# EAGLE design porcupine4v1_7 (EAGLE 6.5.0)
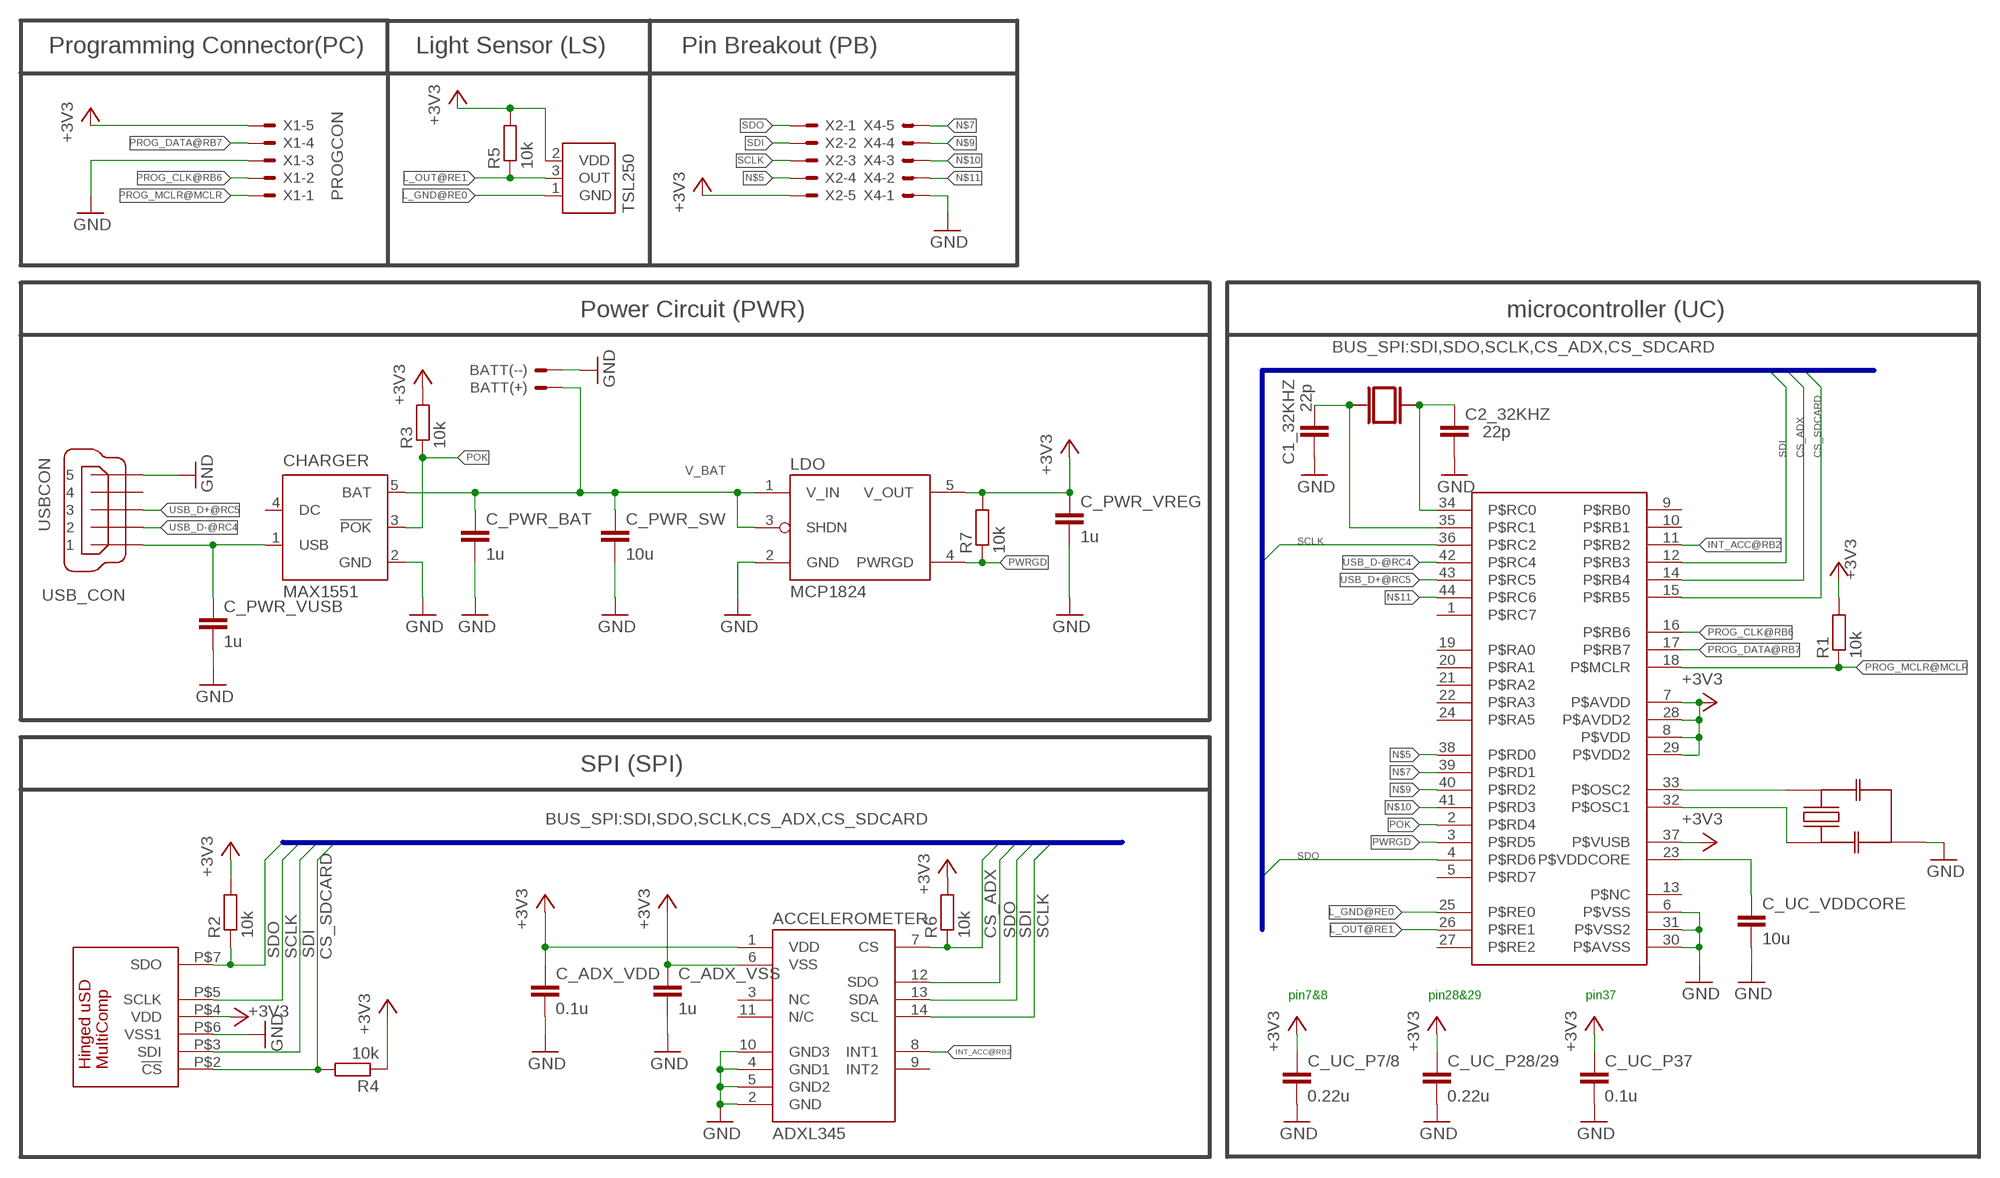
[diagram p0: schematic, sheet 1]

## Parts
12MHZ_RESONATOR  RESONATORPRQC-S  [PRQC]
32KHZ_CRYSTAL  SMD_CRYSTAL  [SMD_CRYSTAL]
ACCELEROMETER  ADXL345  [LGA14]
BATT  LI-ION-PACK  [LI-ION-CONNECT]
C1_32KHZ  22p  C-EUC0603K  [C0603K]
C2_32KHZ  22p  C-EUC0603K  [C0603K]
C_ADX_VDD  0.1u  C-EUC0603K  [C0603K]
C_ADX_VSS  1u  C-EUC0603K  [C0603K]
C_PWR_BAT  1u  C-EUC0603K  [C0603K]
C_PWR_SW  10u  C-EUC0805K  [C0805K]
C_PWR_VREG  1u  C-EUC0603K  [C0603K]
C_PWR_VUSB  1u  C-EUC0603K  [C0603K]
C_UC_P7/8  0.22u  C-EUC0603K  [C0603K]
C_UC_P28/29  0.22u  C-EUC0603K  [C0603K]
C_UC_P37  0.1u  C-EUC0603K  [C0603K]
C_UC_VDDCORE  10u  C-EUC0805K  [C0805K]
CHARGER  MAX1551  [SOT23-5L]
LDO  MCP1824  [SOT-23-5]
LIGHTSENSE  TSL250  [TSL]
PIC_CONTROLLER  PIC_P2V6  [QFN44ML8X8]
R1  10k  R-EU_R0603  [R0603]
R2  10k  R-EU_R0603  [R0603]
R3  10k  R-EU_R0603  [R0603]
R4  10k  R-EU_R0603  [R0603]
R5  10k  R-EU_R0603  [R0603]
R6  10k  R-EU_R0603  [R0603]
R7  10k  R-EU_R0603  [R0603]
SDCARD_CON  MICROSD_CONN  [460DA40013]
USB_CON  USBCON  [248601]
X1  PROGCON  [53047-05-OCT]
X2  PROGCON  [53047-05-OCT]
X4  PROGCON  [53047-05-OCT]

## Nets
+3V3: ACCELEROMETER.1(VDD) ACCELEROMETER.6(VSS) C_ADX_VDD.1 C_ADX_VSS.1 C_PWR_VREG.1 C_UC_P7/8.1 C_UC_P28/29.1 C_UC_P37.1 LDO.5(V_OUT) LIGHTSENSE.2(VDD) PIC_CONTROLLER.7(P$AVDD) PIC_CONTROLLER.8(P$VDD) PIC_CONTROLLER.28(P$AVDD2) PIC_CONTROLLER.29(P$VDD2) PIC_CONTROLLER.37(P$VUSB) R1.2 R2.2 R3.2 R4.1 R5.2 R6.2 R7.2 SDCARD_CON.P$4(VDD) X1.5 X2.5
CS_ADX: ACCELEROMETER.7(CS) PIC_CONTROLLER.14(P$RB4) R6.1
CS_SDCARD: PIC_CONTROLLER.15(P$RB5) R4.2 SDCARD_CON.P$2(!CS)
GND: 12MHZ_RESONATOR.GND ACCELEROMETER.2(GND) ACCELEROMETER.4(GND1) ACCELEROMETER.5(GND2) ACCELEROMETER.10(GND3) BATT.2 C1_32KHZ.2 C2_32KHZ.2 C_ADX_VDD.2 C_ADX_VSS.2 C_PWR_BAT.2 C_PWR_SW.2 C_PWR_VREG.2 C_PWR_VUSB.2 C_UC_P7/8.2 C_UC_P28/29.2 C_UC_P37.2 C_UC_VDDCORE.2 CHARGER.2(GND) LDO.2(GND) PIC_CONTROLLER.6(P$VSS) PIC_CONTROLLER.30(P$AVSS) PIC_CONTROLLER.31(P$VSS2) SDCARD_CON.P$6(VSS1) USB_CON.5 X1.3 X4.1
INT_ACC@RB2: ACCELEROMETER.8(INT1) PIC_CONTROLLER.11(P$RB2)
L_GND@RE0: LIGHTSENSE.1(GND) PIC_CONTROLLER.25(P$RE0)
L_OUT@RE1: LIGHTSENSE.3(OUT) PIC_CONTROLLER.26(P$RE1) R5.1
N$1: 12MHZ_RESONATOR.2 PIC_CONTROLLER.32(P$OSC1)
N$2: 12MHZ_RESONATOR.1 PIC_CONTROLLER.33(P$OSC2)
N$3: 32KHZ_CRYSTAL.P$2 C2_32KHZ.1 PIC_CONTROLLER.34(P$RC0)
N$5: PIC_CONTROLLER.38(P$RD0) X2.4
N$6: 32KHZ_CRYSTAL.P$1 C1_32KHZ.1 PIC_CONTROLLER.35(P$RC1)
N$7: PIC_CONTROLLER.39(P$RD1) X4.5
N$9: PIC_CONTROLLER.40(P$RD2) X4.4
N$10: PIC_CONTROLLER.41(P$RD3) X4.3
N$11: PIC_CONTROLLER.44(P$RC6) X4.2
POK: CHARGER.3(!POK) PIC_CONTROLLER.2(P$RD4) R3.1
PROG_CLK@RB6: PIC_CONTROLLER.16(P$RB6) X1.2
PROG_DATA@RB7: PIC_CONTROLLER.17(P$RB7) X1.4
PROG_MCLR@MCLR: PIC_CONTROLLER.18(P$MCLR) R1.1 X1.1
PWRGD: LDO.4(PWRGD) PIC_CONTROLLER.3(P$RD5) R7.1
SCLK: ACCELEROMETER.14(SCL) PIC_CONTROLLER.36(P$RC2) SDCARD_CON.P$5(SCLK) X2.3
SDI: ACCELEROMETER.13(SDA) PIC_CONTROLLER.12(P$RB3) SDCARD_CON.P$3(SDI) X2.2
SDO: ACCELEROMETER.12(SDO) PIC_CONTROLLER.4(P$RD6) R2.1 SDCARD_CON.P$7(SDO) X2.1
USB_D+@RC5: PIC_CONTROLLER.43(P$RC5) USB_CON.3
USB_D-@RC4: PIC_CONTROLLER.42(P$RC4) USB_CON.2
V_BAT: BATT.1 C_PWR_BAT.1 C_PWR_SW.1 CHARGER.5(BAT) LDO.1(V_IN) LDO.3(SHDN)
V_USB: C_PWR_VUSB.1 CHARGER.1(USB) USB_CON.1
VDDCORE: C_UC_VDDCORE.1 PIC_CONTROLLER.23(P$VDDCORE)
Unconnected: ACCELEROMETER.3(NC) ACCELEROMETER.9(INT2) ACCELEROMETER.11(N/C) CHARGER.4(DC) PIC_CONTROLLER.1(P$RC7) PIC_CONTROLLER.9(P$RB0) PIC_CONTROLLER.10(P$RB1) PIC_CONTROLLER.13(P$NC) PIC_CONTROLLER.19(P$RA0) PIC_CONTROLLER.20(P$RA1) PIC_CONTROLLER.21(P$RA2) PIC_CONTROLLER.22(P$RA3) PIC_CONTROLLER.24(P$RA5) PIC_CONTROLLER.27(P$RE2) USB_CON.4

## Buses
BUS_SPI:SDI,SDO,SCLK,CS_ADX,CS_SDCARD

## Notes on the sheet
- Programming Connector(PC) | Light Sensor (LS) | Pin Breakout (PB)
- Power Circuit (PWR) | microcontroller (UC)
- SPI (SPI)
- pin7&8 | pin28&29 | pin37

## Power pins joined to a net without a drawn wire
P$RD7: PIC_CONTROLLER.5(P$RD7)

## Library data of the parts
12MHZ_RESONATOR = jnode:RESONATOR: Ceramic Resonator with caps AWSCR-16.00CV-T: 16Mhz ceramic resonator with 22pF capacitors PRQC16.00SR5010X000: 16Mhz ceramic resonator with 10pF capacitors; DIGIKEY: http://www.digikey.com/product-detail/en/PRQC12.00CR5010X000/478-6318-1-ND/2506334
32KHZ_CRYSTAL = HedgehogLib:SMD_CRYSTAL
ACCELEROMETER = HedgehogLib:ADXL345
BATT = HedgehogLib:LI-ION-PACK: Lithium Ion Battery Pack
C1_32KHZ C2_32KHZ C_ADX_VDD C_ADX_VSS C_PWR_BAT C_PWR_SW C_PWR_VREG C_PWR_VUSB C_UC_P7/8 C_UC_P28/29 C_UC_P37 C_UC_VDDCORE = rcl:C-EU: CAPACITOR, European symbol
CHARGER = maxim:MAX1551: Dual-Input USB/AC Adapter 1-Cell Li+ Battery Chargers Source: http://www.maxim-ic.com .. MAX1551-MAX1555.pdf; MF: MAXIM; MPN: MAX1551EZK-T; OC_FARNELL: 1628221; OC_NEWARK: 88H0599
LDO = HedgehogLib:MCP1824: MCP1824T-3302E/OT http://de.farnell.com/1578387
LIGHTSENSE = HedgehogLib:TSL250
PIC_CONTROLLER = HedgehogLib:PIC_P2V6
R1-R7 = rcl:R-EU_: RESISTOR, European symbol
SDCARD_CON = HedgehogLib:MICROSD_CONN
USB_CON = HedgehogLib:USBCON: MINI USB 2.0 Connector TypeB
X1 X2 X4 = HedgehogLib:PROGCON: Programmer Connector wire to board 1.25 mm (.049 inch) pitch header

## Board
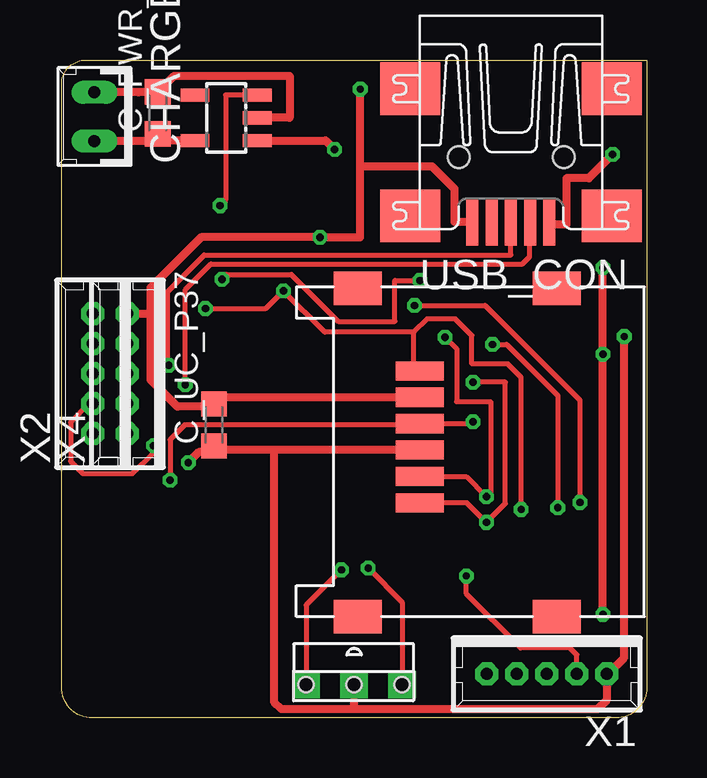
[diagram p1: board, top side]
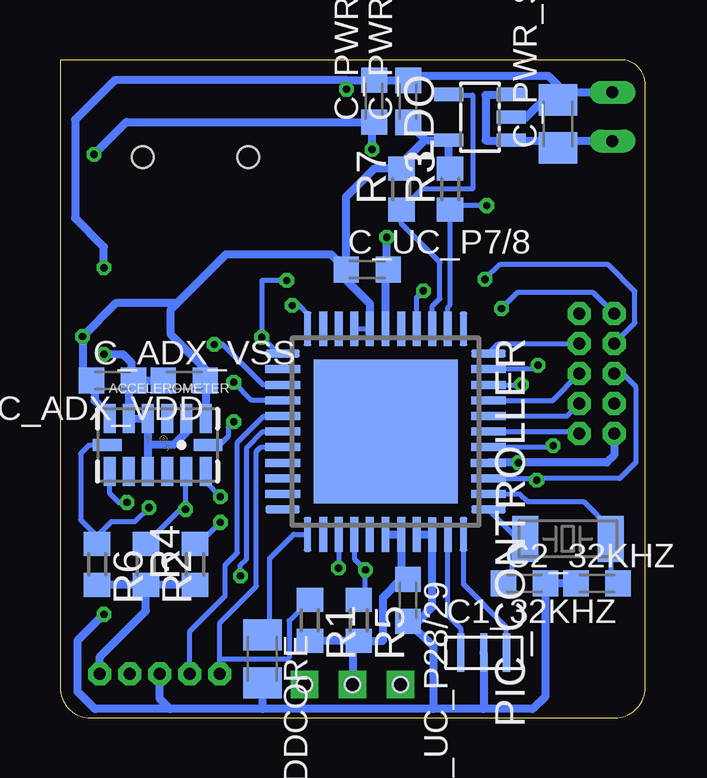
[diagram p2: board, bottom side, seen from below]

Size 24.38 x 27.43 mm. Coordinates in mm from the lower left corner, seen from the top.
Outline: 1.27,0 arc-90 0,1.27 0,26.42 arc-90 1.02,27.43 24.38,27.43 24.38,1.27 arc-90 23.11,0 1.27,0
Copper layers (1*16): Top 0.035mm / dielectric 1.5mm / Bottom 0.035mm
Design rules "default": minimum track width 6mil, minimum drill 12mil, track to track 7mil, track to pad 7mil, pad to pad 7mil, via to via 7mil, smd to smd 7mil, copper to edge 6mil, drill to drill 6mil, minimum pad ring 9mil, minimum via ring 6mil, stop-mask expansion 4mil, vias tented up to drill 0mil, thermal gap 10mil

### Footprints (pad centres in the part's own frame; a part is rotated, then mirrored left to right if it is on the bottom)
PRQC = smd 0.3 x 1.6: 1 -0.95,0; 2 0.95,0; GND 0,0
SMD_CRYSTAL = smd 1.092 x 1.905: P$1 1.794,0; P$2 -1.778,0
LGA14 = smd 0.5 x 1.2: 1 2,1.1; 2 1.2,1.1; 3 0.4,1.1; 4 -0.4,1.1; 5 -1.2,1.1; 6 -2,1.1; 8 -2,-1.1; 9 -1.2,-1.1; 10 -0.4,-1.1; 11 0.4,-1.1; 12 1.2,-1.1; 13 2,-1.1 | smd 1.2 x 0.5: 7 -2.1,0; 14 2.1,0
LI-ION-CONNECT = drill 0.5 pad 0.698 long: 1 -1.016,0; 2 1.016,0
C0603K = smd 1.05 x 1.08: 1 -0.875,0; 2 0.875,0
C0805K = smd 1.3 x 1.6: 1 -1,0; 2 1,0
SOT23-5L = smd 0.55 x 1.2: 1 -0.95,-1.3; 2 0,-1.3; 3 0.95,-1.3; 4 0.95,1.3; 5 -0.95,1.3
SOT-23-5 = smd 0.55 x 1.2: 1 -0.95,-1.3; 2 0,-1.3; 3 0.95,-1.3; 4 0.95,1.3; 5 -0.95,1.3
TSL = drill 0.635 pad 1.15 square: 1 -1.999,0; 2 0,0; 3 1.999,0 | hole 0.635: 0,0; -2,0; 2,0
QFN44ML8X8 = smd 1.45 x 0.33: 1 -4.282,3.25; 2 -4.285,2.6; 3 -4.285,1.95; 4 -4.285,1.3; 5 -4.285,0.65; 6 -4.287,0; 7 -4.285,-0.649; 8 -4.287,-1.3; 9 -4.287,-1.949; 10 -4.285,-2.6; 11 -4.285,-3.25; 23 4.285,-3.25; 24 4.287,-2.6; 25 4.287,-1.95; 26 4.287,-1.3; 27 4.287,-0.652; 28 4.287,0; 29 4.287,0.65; 30 4.292,1.3; 31 4.293,1.953; 32 4.293,2.602; 33 4.285,3.25 | smd 0.33 x 1.45: 12 -3.25,-4.288; 13 -2.6,-4.287; 14 -1.949,-4.287; 15 -1.3,-4.287; 16 -0.65,-4.287; 17 0,-4.287; 18 0.65,-4.287; 19 1.3,-4.287; 20 1.95,-4.287; 21 2.6,-4.287; 22 3.25,-4.285; 34 3.25,4.288; 35 2.6,4.287; 36 1.95,4.287; 37 1.3,4.285; 38 0.65,4.287; 39 0,4.287; 40 -0.649,4.287; 41 -1.3,4.287; 42 -1.949,4.287; 43 -2.6,4.287; 44 -3.25,4.288 | smd 6 x 6: EXP 0,0
R0603 = smd 1 x 1.1: 1 -0.85,0; 2 0.85,0
460DA40013 = smd 2 x 0.8: P$2 9.35,-4.75; P$3 9.35,-5.85; P$4 9.35,-6.95; P$5 9.35,-8.05; P$6 9.35,-9.15; P$7 9.35,-10.25 | smd 2 x 1.4: P$9A 11.95,0; P$9B 3.65,0; P$10A 11.95,-13.7; P$10B 3.65,-13.7
248601 = smd 2 x 0.5: 1 2.25,1.6; 2 2.25,0.8; 3 2.25,0; 4 2.25,-0.8; 5 2.25,-1.6 | smd 2.2 x 2.5: M1 -3.3,-4.2; M2 -3.3,4.2; M3 2,4.2; M4 2,-4.2 | hole 0.9: -0.449,-2.177; -0.447,2.21
53047-05-OCT = drill 0.5 pad 0.889 octagon: 1 2.5,0; 2 1.25,0; 3 0,0; 4 -1.25,0; 5 -2.5,0

### Placement (x,y rotation side)
12MHZ_RESONATOR  6.73,2.72 180 bottom
32KHZ_CRYSTAL  3.23,7.47 0 bottom
ACCELEROMETER  20.32,11.38 0 bottom
BATT  1.37,25.07 90 top
C1_32KHZ  2.01,5.61 180 bottom
C2_32KHZ  5.03,5.61 0 bottom
C_ADX_VDD  19.2,14.07 180 bottom
C_ADX_VSS  22.2,14.07 0 bottom
C_PWR_BAT  4.01,25.22 90 top
C_PWR_SW  3.63,24.77 90 bottom
C_PWR_VREG  9.88,25.7 90 bottom
C_PWR_VUSB  11.3,25.71 90 bottom
C_UC_P7/8  11.58,18.69 0 bottom
C_UC_P28/29  9.88,4.9 270 bottom
C_UC_P37  6.35,12.22 90 top
C_UC_VDDCORE  15.95,2.46 270 bottom
CHARGER  6.86,25.02 90 top
LDO  6.88,25.04 90 bottom
LIGHTSENSE  12.19,1.4 180 top
PIC_CONTROLLER  10.82,11.94 270 bottom
R1  13.97,4.06 270 bottom
R2  20.8,6.4 270 bottom
R3  8.13,22.05 90 bottom
R4  18.76,6.4 90 bottom
R5  11.94,4.06 270 bottom
R6  22.83,6.4 270 bottom
R7  10.16,22.05 90 bottom
SDCARD_CON  24.28,4.22 180 top
USB_CON  18.72,22.93 270 top
X1  20.22,1.83 180 top
X2  1.3,14.35 90 top
X4  2.74,14.35 90 top

### Tracks (layer width: path | path; a pad name or v marks a point on that pad's centre or on a via)
+3V3  (via drill 0.3)
  Top 0.33: 12.19,0.37 LIGHTSENSE.2 | 12.19,0.37 22.34,0.37 22.73,0.76 22.73,1.81 X1.5 22.76,1.83 23.44,2.52 v23.44,15.9 | 14.92,11.15 SDCARD_CON.P$4 8.85,11.17 | 8.85,11.17 6.43,11.17 C_UC_P37.1 6.42,11.09 5.73,11.09 v5.28,10.64 | 8.85,11.17 8.85,0.68 9.15,0.37 12.19,0.37
  Bottom 0.203: C_ADX_VDD.1 18.32,13.84 | PIC_CONTROLLER.7 PIC_CONTROLLER.8 | 23.19,13.93 C_ADX_VSS.1 23.1,14.03 23.44,14.38 | 18.34,13.85 C_ADX_VDD.1 | PIC_CONTROLLER.37 | 18.33,13.84 C_ADX_VDD.1 | 18.29,12.7 18.32,12.17 ACCELEROMETER.1
  Bottom 0.33: ACCELEROMETER.6 22.32,12.91 22.61,12.91 22.94,13.23 22.94,13.81 C_ADX_VSS.1 | 18.32,13.84 ACCELEROMETER.1 | v23.44,15.9 23.44,14.38 | PIC_CONTROLLER.7 11.47,17.27 12.46,18.26 C_UC_P7/8.1 | PIC_CONTROLLER.37 v5.28,10.64 1.6,10.64 1.29,10.95 X2.5 | R2.2 R6.2 | X1.5 22.72,2.56 20.8,4.47 R2.2 | 23.42,15.93 v23.44,15.9 | R4.1 R2.2 | v23.44,15.9 22.04,17.31 19.48,17.31 | R3.2 8.18,22.93 8.18,24.07 9.12,24.07 9.16,24.11 | 9.16,24.11 C_PWR_VREG.1 | 9.16,24.11 9.98,23.29 R7.2 11.29,22.9 12.46,21.73 C_UC_P7/8.1 | C_UC_P7/8.1 13.09,19.33 17.46,19.33 19.48,17.31 | C_ADX_VDD.1 18.33,14.54 19.76,15.98 19.76,17.03 19.48,17.31 | 12.19,3.21 R5.2 10.92,3.21 10.92,5.03 10.18,5.77 C_UC_P28/29.1 10.17,5.75 PIC_CONTROLLER.29 PIC_CONTROLLER.28 | 12.19,3.21 LIGHTSENSE.2 | 12.19,3.21 R1.2
  Bottom 0.406: LDO.5 8.18,24.07
CS_ADX  (via drill 0.3)
  Top 0.203: v20.68,8.76 20.68,13.44 18.54,15.57 v17.96,15.57
  Bottom 0.203: ACCELEROMETER.7 23.16,11.38 23.52,11.02 23.52,8.26 22.84,7.57 | v20.68,8.76 21.26,8.18 22.25,8.18 22.84,7.59 22.84,7.57 | R6.1 22.84,7.57 | PIC_CONTROLLER.14 15.92,13.89 17.6,15.57 v17.96,15.57
CS_SDCARD  (via drill 0.3)
  Top 0.203: SDCARD_CON.P$2 16.89,8.97 v17.7,8.15 18.49,8.94 18.49,13.99 v17.14,13.99
  Bottom 0.203: R4.2 18.35,7.5 v17.7,8.15 | PIC_CONTROLLER.15 16.39,13.24 v17.14,13.99
GND  (via drill 0.3, 0.3 pad 0.3)
  Top 0.33: 17.14,20.58 USB_CON.5 16.38,20.68 16.38,22.05 15.44,22.99 12.45,22.99 | v22.55,18.77 v22.55,15.16 v22.55,4.32 | C_PWR_BAT.2 3.21,26.09 BATT.2 | 3.68,25.86 C_PWR_BAT.2 | SDCARD_CON.P$6 6.42,13.37 | 6.42,13.37 C_UC_P37.2 6.15,13.26 | 6.42,13.37 6.04,12.98 4.83,12.98 3.71,14.1 3.71,16.89 | 3.71,16.89 3.71,17.93 5.82,20.04 v10.77,20.04 12.45,20.04 12.45,22.99 | CHARGER.2 9.5,25.02 9.5,26.77 4.69,26.77 C_PWR_BAT.2 | 12.45,22.99 v12.45,26.21 | X4.1 3.54,16.85 3.71,16.89
  Bottom 0.203: 21.52,13.82 21.44,13.82 C_ADX_VSS.2
  Bottom 0.33: 21.52,13.82 ACCELEROMETER.5 ACCELEROMETER.4 20.72,11.39 | 20.72,11.39 ACCELEROMETER.10 | ACCELEROMETER.2 19.12,11.91 19.63,11.39 20.72,11.39 | C_ADX_VDD.2 C_ADX_VSS.2 21.41,13.9 21.41,14.81 21.77,15.16 v22.55,15.16 | 15.94,0.38 C_UC_VDDCORE.2 15.64,1.46 15.57,1.4 | 15.94,0.38 19.81,0.38 | v22.55,18.77 22.55,19.63 23.75,20.83 23.75,24.94 22.11,26.59 12.45,26.59 | 19.81,0.38 22.93,0.38 23.65,1.09 23.65,3.23 v22.55,4.32 | 6.73,0.38 8.84,0.38 | 8.84,0.38 15.94,0.38 | 19.81,0.38 20.22,0.79 X1.3 | v12.45,26.21 12.45,26.59 | C1_32KHZ.2 4.18,5.61 C2_32KHZ.2 4.15,0.91 4.69,0.38 6.73,0.38 | 12MHZ_RESONATOR.GND 6.73,0.38 | PIC_CONTROLLER.6 10.82,18.58 C_UC_P7/8.2 10.77,18.76 v10.77,20.04 | 5.58,25.02 4.98,25.02 3.9,26.09 C_PWR_SW.2 | 12.45,26.59 C_PWR_VUSB.2 11.44,26.58 C_PWR_VREG.2 9.99,26.77 4.04,26.77 3.63,26.36 C_PWR_SW.2 | C_PWR_SW.2 3.21,26.09 BATT.2 | 8.84,0.38 8.84,2.98 C_UC_P28/29.2 9.47,4.02 8.87,4.62 PIC_CONTROLLER.31 8.96,7.64 PIC_CONTROLLER.30
  Bottom 0.406: 5.58,25.02 LDO.2
INT_ACC@RB2  (via drill 0.3)
  Top 0.203: v14.71,17.2 17.65,17.2 21.6,13.25 v21.6,8.98
  Bottom 0.203: ACCELEROMETER.8 22.32,9.36 21.94,8.98 v21.6,8.98 | v14.71,17.2 14.4,17.2 14.07,16.86 PIC_CONTROLLER.11
L_GND@RE0  (via drill 0.3)
  Top 0.203: v12.78,6.25 14.19,4.83 LIGHTSENSE.1
  Bottom 0.203: PIC_CONTROLLER.25 12.77,6.36 v12.78,6.25
L_OUT@RE1  (via drill 0.3)
  Top 0.203: v11.66,6.17 10.19,4.71 LIGHTSENSE.3
  Bottom 0.203: PIC_CONTROLLER.26 12.12,6.63 v11.66,6.17 11.66,5.07 R5.1
N$1
  Bottom 0.203: 12MHZ_RESONATOR.2 7.67,3.71 8.22,4.27 PIC_CONTROLLER.32
N$2
  Bottom 0.203: 12MHZ_RESONATOR.1 5.78,3.77 7.57,5.56 PIC_CONTROLLER.33
N$3
  Bottom 0.203: PIC_CONTROLLER.34 5.31,7.46 32KHZ_CRYSTAL.P$2 5.56,6.93 5.56,5.98 C2_32KHZ.1
N$5  (via drill 0.3)
  Top 0.203: v3.83,11.35 3.83,11.07 2.95,10.19 0.89,10.19 0.38,10.69 0.38,12.32 1.16,13.1 X2.4
  Bottom 0.203: v3.83,11.35 4.04,11.35 4.12,11.28 6.52,11.28 PIC_CONTROLLER.38
N$6
  Bottom 0.203: PIC_CONTROLLER.35 5.22,9.34 4.9,9.02 2.56,9.02 1.45,7.9 32KHZ_CRYSTAL.P$1 1.44,5.89 C1_32KHZ.1
N$7
  Bottom 0.203: PIC_CONTROLLER.39 2.96,11.94 X4.5
N$9
  Bottom 0.203: PIC_CONTROLLER.40 3.26,12.59 X4.4
N$10
  Bottom 0.203: PIC_CONTROLLER.41 3.86,13.23 X4.3
N$11
  Bottom 0.203: PIC_CONTROLLER.44 6.12,15.6 X4.2
POK  (via drill 0.3)
  Top 0.203: CHARGER.3 6.83,25.97 6.83,21.59 v6.6,21.36
  Bottom 0.203: PIC_CONTROLLER.2 8.22,17.13 8.13,17.22 R3.1 7.98,21.36 v6.6,21.36
PROG_CLK@RB6
  Bottom 0.203: PIC_CONTROLLER.16 15.88,12.59 16.99,11.48 16.99,6.88 17.5,6.38 17.5,5.08 18.97,3.61 X1.2
PROG_DATA@RB7  (via drill 0.3)
  Top 0.203: v16.87,5.92 16.87,5.18 19.13,2.92 21.18,2.92 21.47,2.64 X1.4
  Bottom 0.203: v16.87,5.92 16.87,6.38 16.61,6.63 16.61,11.25 15.93,11.94 PIC_CONTROLLER.17
PROG_MCLR@MCLR
  Bottom 0.203: PIC_CONTROLLER.18 16.02,11.29 16.2,11.1 16.2,5.49 17.72,3.97 17.72,2.44 | X1.1 17.72,2.44 | R1.1 14.83,4.05 14.83,2.52 14.91,2.44 17.72,2.44
PWRGD
  Bottom 0.203: 8.18,25.97 7.19,25.97 7.19,22.05 9.31,22.05 R7.1 10.16,20.6 8.56,19 8.56,17.48 8.87,17.16 PIC_CONTROLLER.3
  Bottom 0.406: 8.18,25.97 LDO.4
SCLK  (via drill 0.3)
  Top 0.203: v4.52,9.91 4.52,11.61 5.13,12.22 14.88,12.22 SDCARD_CON.P$5 17.07,12.27 v17.14,12.34
  Bottom 0.203: v17.14,12.34 17.37,12.12 17.37,11.73 17.75,11.35 18.09,11.35 18.17,11.43 ACCELEROMETER.14 | PIC_CONTROLLER.36 4.6,9.99 v4.52,9.91 4.45,9.98 1.07,9.98 0.38,10.67 0.38,13.79 0.94,14.35 X2.3
SDI  (via drill 0.3)
  Top 0.203: v15.98,15.88 16.46,15.39 16.46,13.18 17.88,13.18 17.88,9.4 v17.7,9.22 16.86,10.07 SDCARD_CON.P$3 | v6.68,18.29 6.88,18.49 9.58,18.49 11.53,16.54 13.89,16.54 13.89,18.24 v14.94,18.24
  Bottom 0.203: PIC_CONTROLLER.12 15.29,15.19 v15.98,15.88 15.98,18.24 v14.94,18.24 | ACCELEROMETER.13 18.32,9.84 v17.7,9.22 | v6.68,18.29 6.07,18.9 1.55,18.9 0.43,17.78 0.43,16.46 X2.2
SDO  (via drill 0.3)
  Top 0.203: v19.15,8.69 19.15,14.2 18.59,14.76 17.09,14.76 17.09,15.95 16.41,16.64 15.23,16.64 14.68,16.08 | SDCARD_CON.P$7 14.68,14.45 14.68,16.08 | 14.68,16.08 10.97,16.08 v9.25,17.8 8.51,17.07 v5.99,17.07
  Bottom 0.203: ACCELEROMETER.12 19.15,10.31 v19.15,8.69 19.2,8.64 19.43,8.64 20.54,7.53 R2.1 | PIC_CONTROLLER.4 9.52,17.53 v9.25,17.8 | X2.1 2.17,17.73 5.33,17.73 v5.99,17.07
USB_D+@RC5  (via drill 0.3)
  Top 0.203: USB_CON.3 18.72,20.56 18.72,19.3 5.94,19.3 4.42,17.78 4.42,14.76 v4.47,14.71
  Bottom 0.203: v4.47,14.71 4.63,14.54 PIC_CONTROLLER.43
USB_D-@RC4  (via drill 0.3)
  Top 0.203: USB_CON.2 19.51,20.54 19.51,19.23 19.2,18.92 6.22,18.92 5.16,17.86 v5.16,13.89
  Bottom 0.203: v5.16,13.89 5.3,13.89 PIC_CONTROLLER.42
V_BAT
  Top 0.33: BATT.1 3.64,24.05 C_PWR_BAT.1 3.71,24.07 CHARGER.5
  Bottom 0.33: 5.58,25.97 6.66,25.97 6.66,24.07 CHARGER.5 3.83,24.07 C_PWR_SW.1 3.24,24.05 BATT.1
  Bottom 0.406: 5.58,25.97 LDO.3 | LDO.1 5.56,24.09 CHARGER.5
V_USB  (via drill 0.3, 0.3 pad 0.3)
  Top 0.33: 20.32,20.81 USB_CON.1 20.32,20.56 21.03,20.57 21.03,22.5 21.97,22.5 v22.96,23.5 | CHARGER.1 11.01,24.07 v11.38,23.7
  Bottom 0.33: v22.96,23.5 21.61,24.84 C_PWR_VUSB.1 11.38,24.77 v11.38,23.7
VDDCORE
  Bottom 0.203: C_UC_VDDCORE.1 15.65,3.77 15.65,6.66 14.65,7.65 PIC_CONTROLLER.23